# EasyEDA Pro project Motor_Driver.eprj, schematic Schematic1

## Sheets
1 P1: Board Name: Board1; Create Date: 2026-08-05; Page Name: P1; Project Name: Motor_Driver; Schematic Name: Schematic1; Update Date: 2026-08-26; Company: 嘉立创EDA; Page Size: A4; Version: V1.0
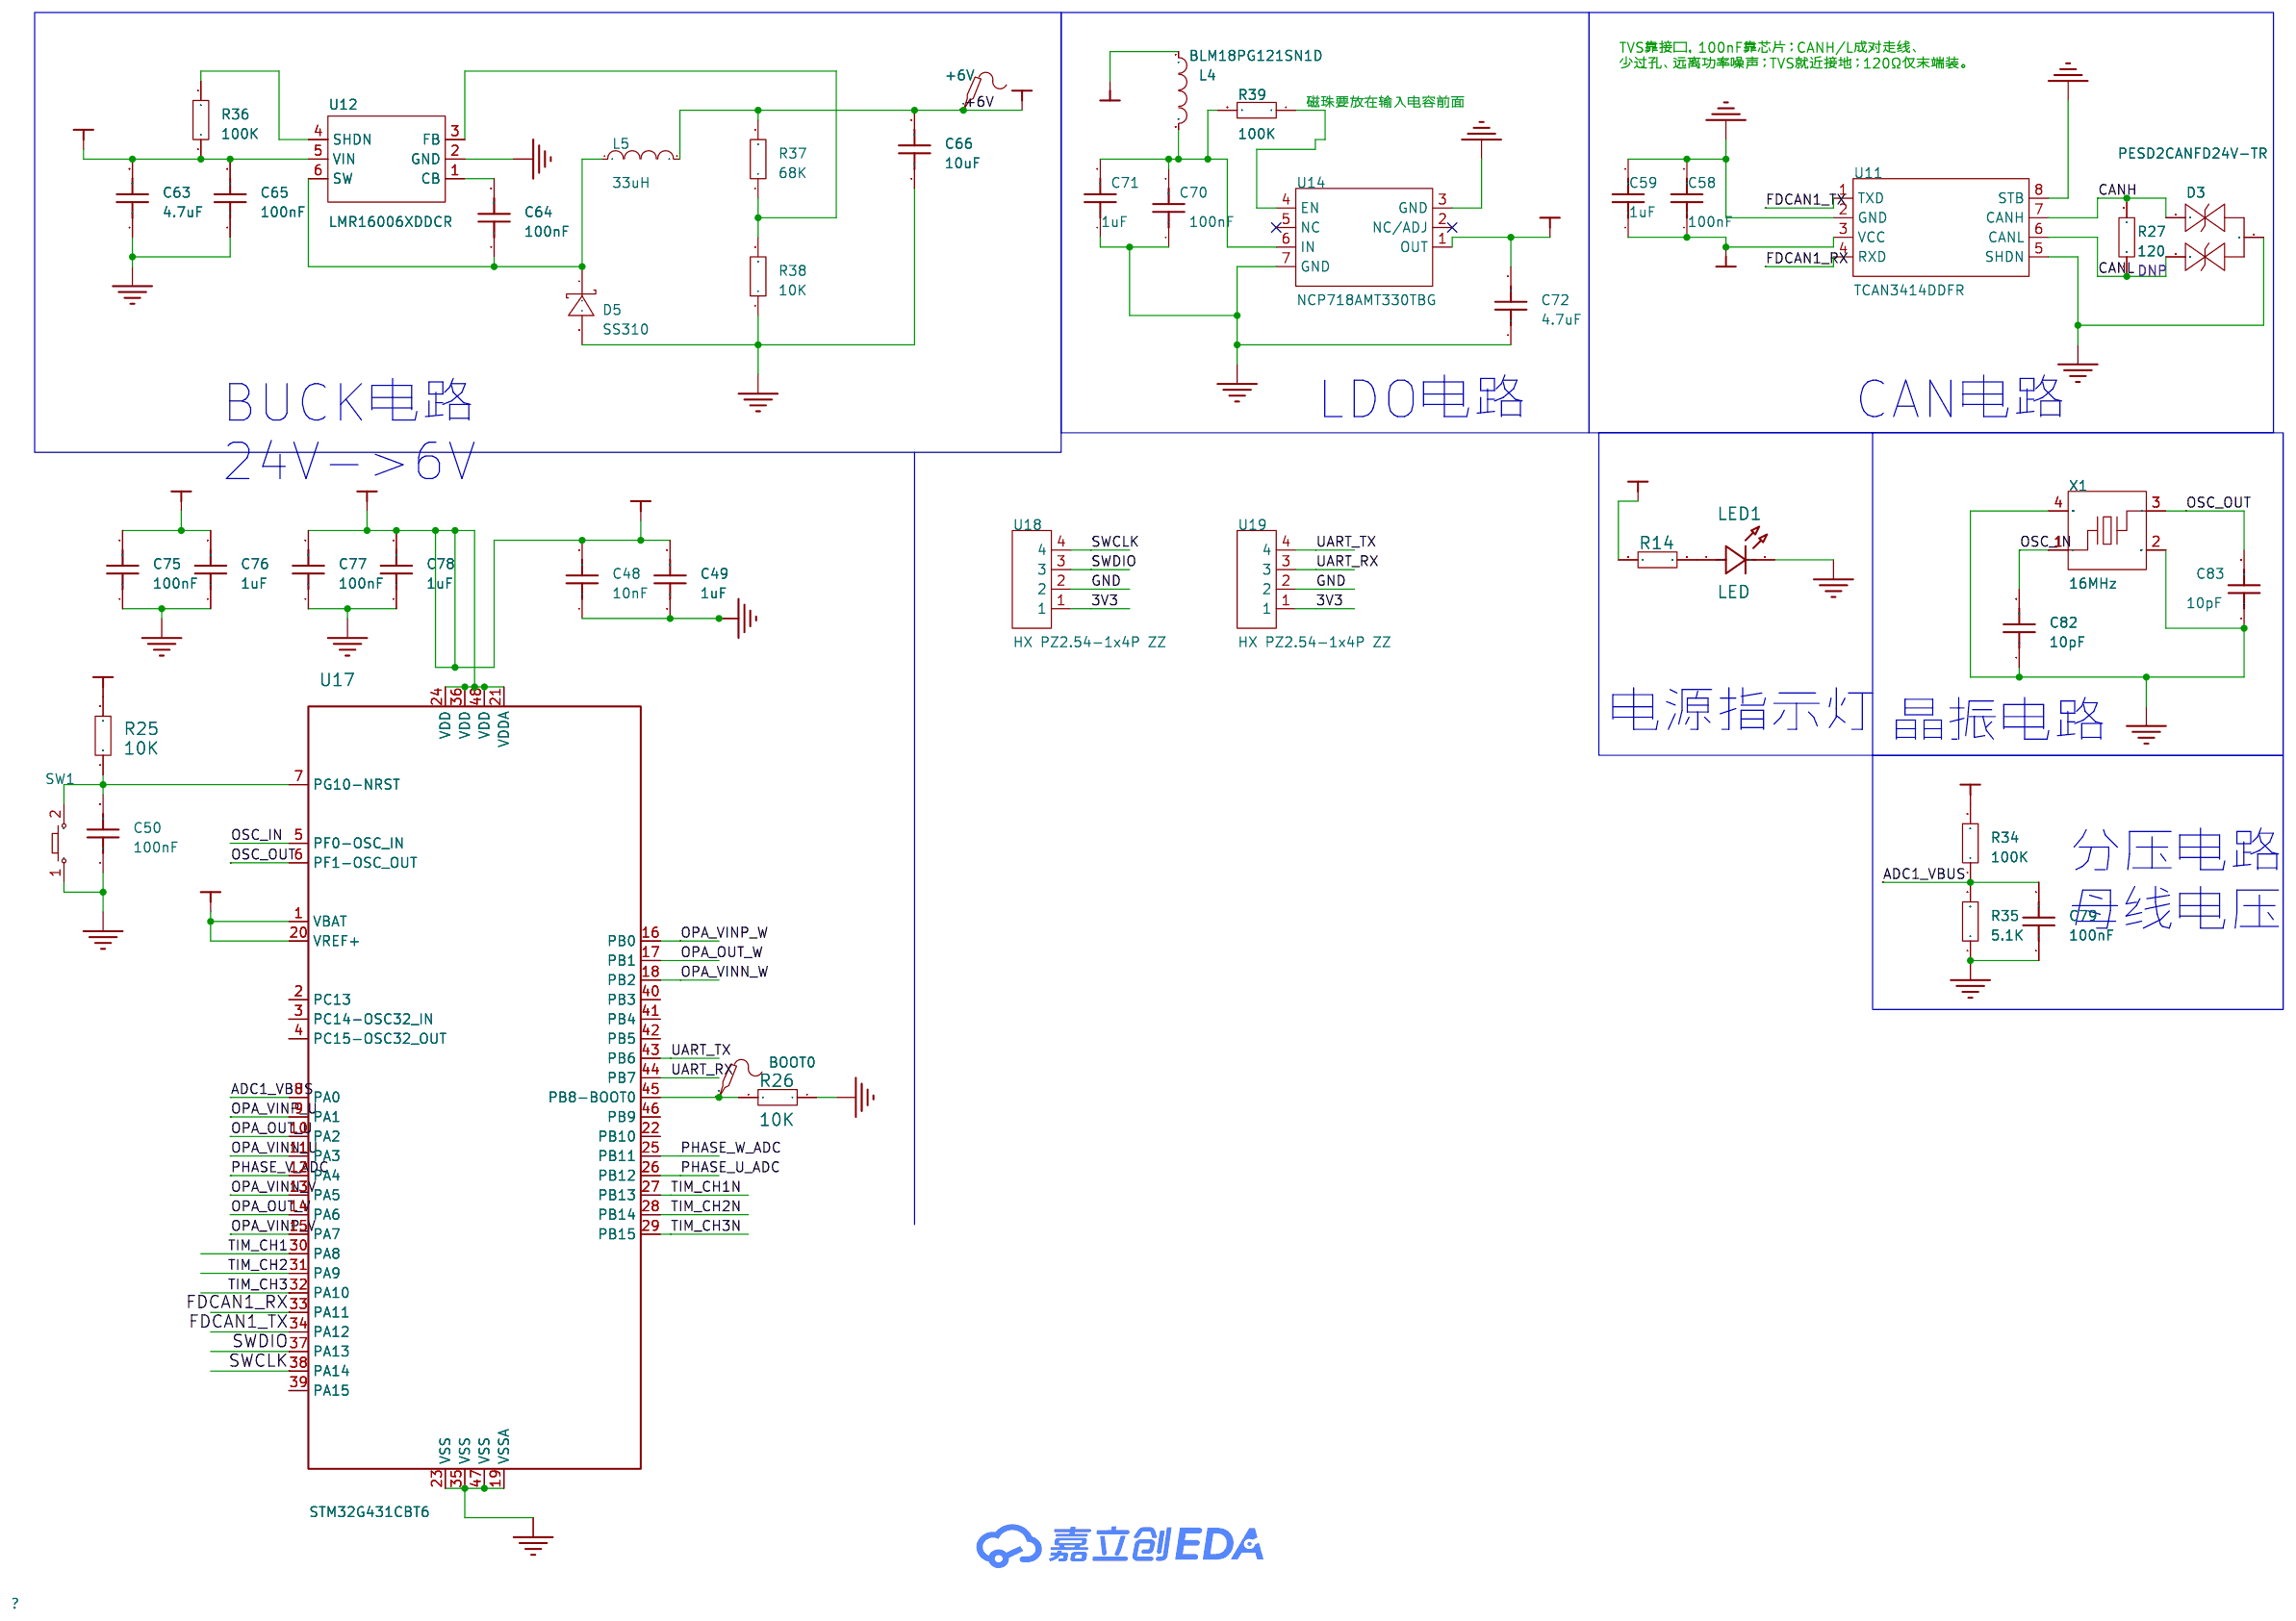
[diagram p0: P1]
2 P2: Create Date: 2026-08-13; Page Name: P2; Update Date: 2026-08-27
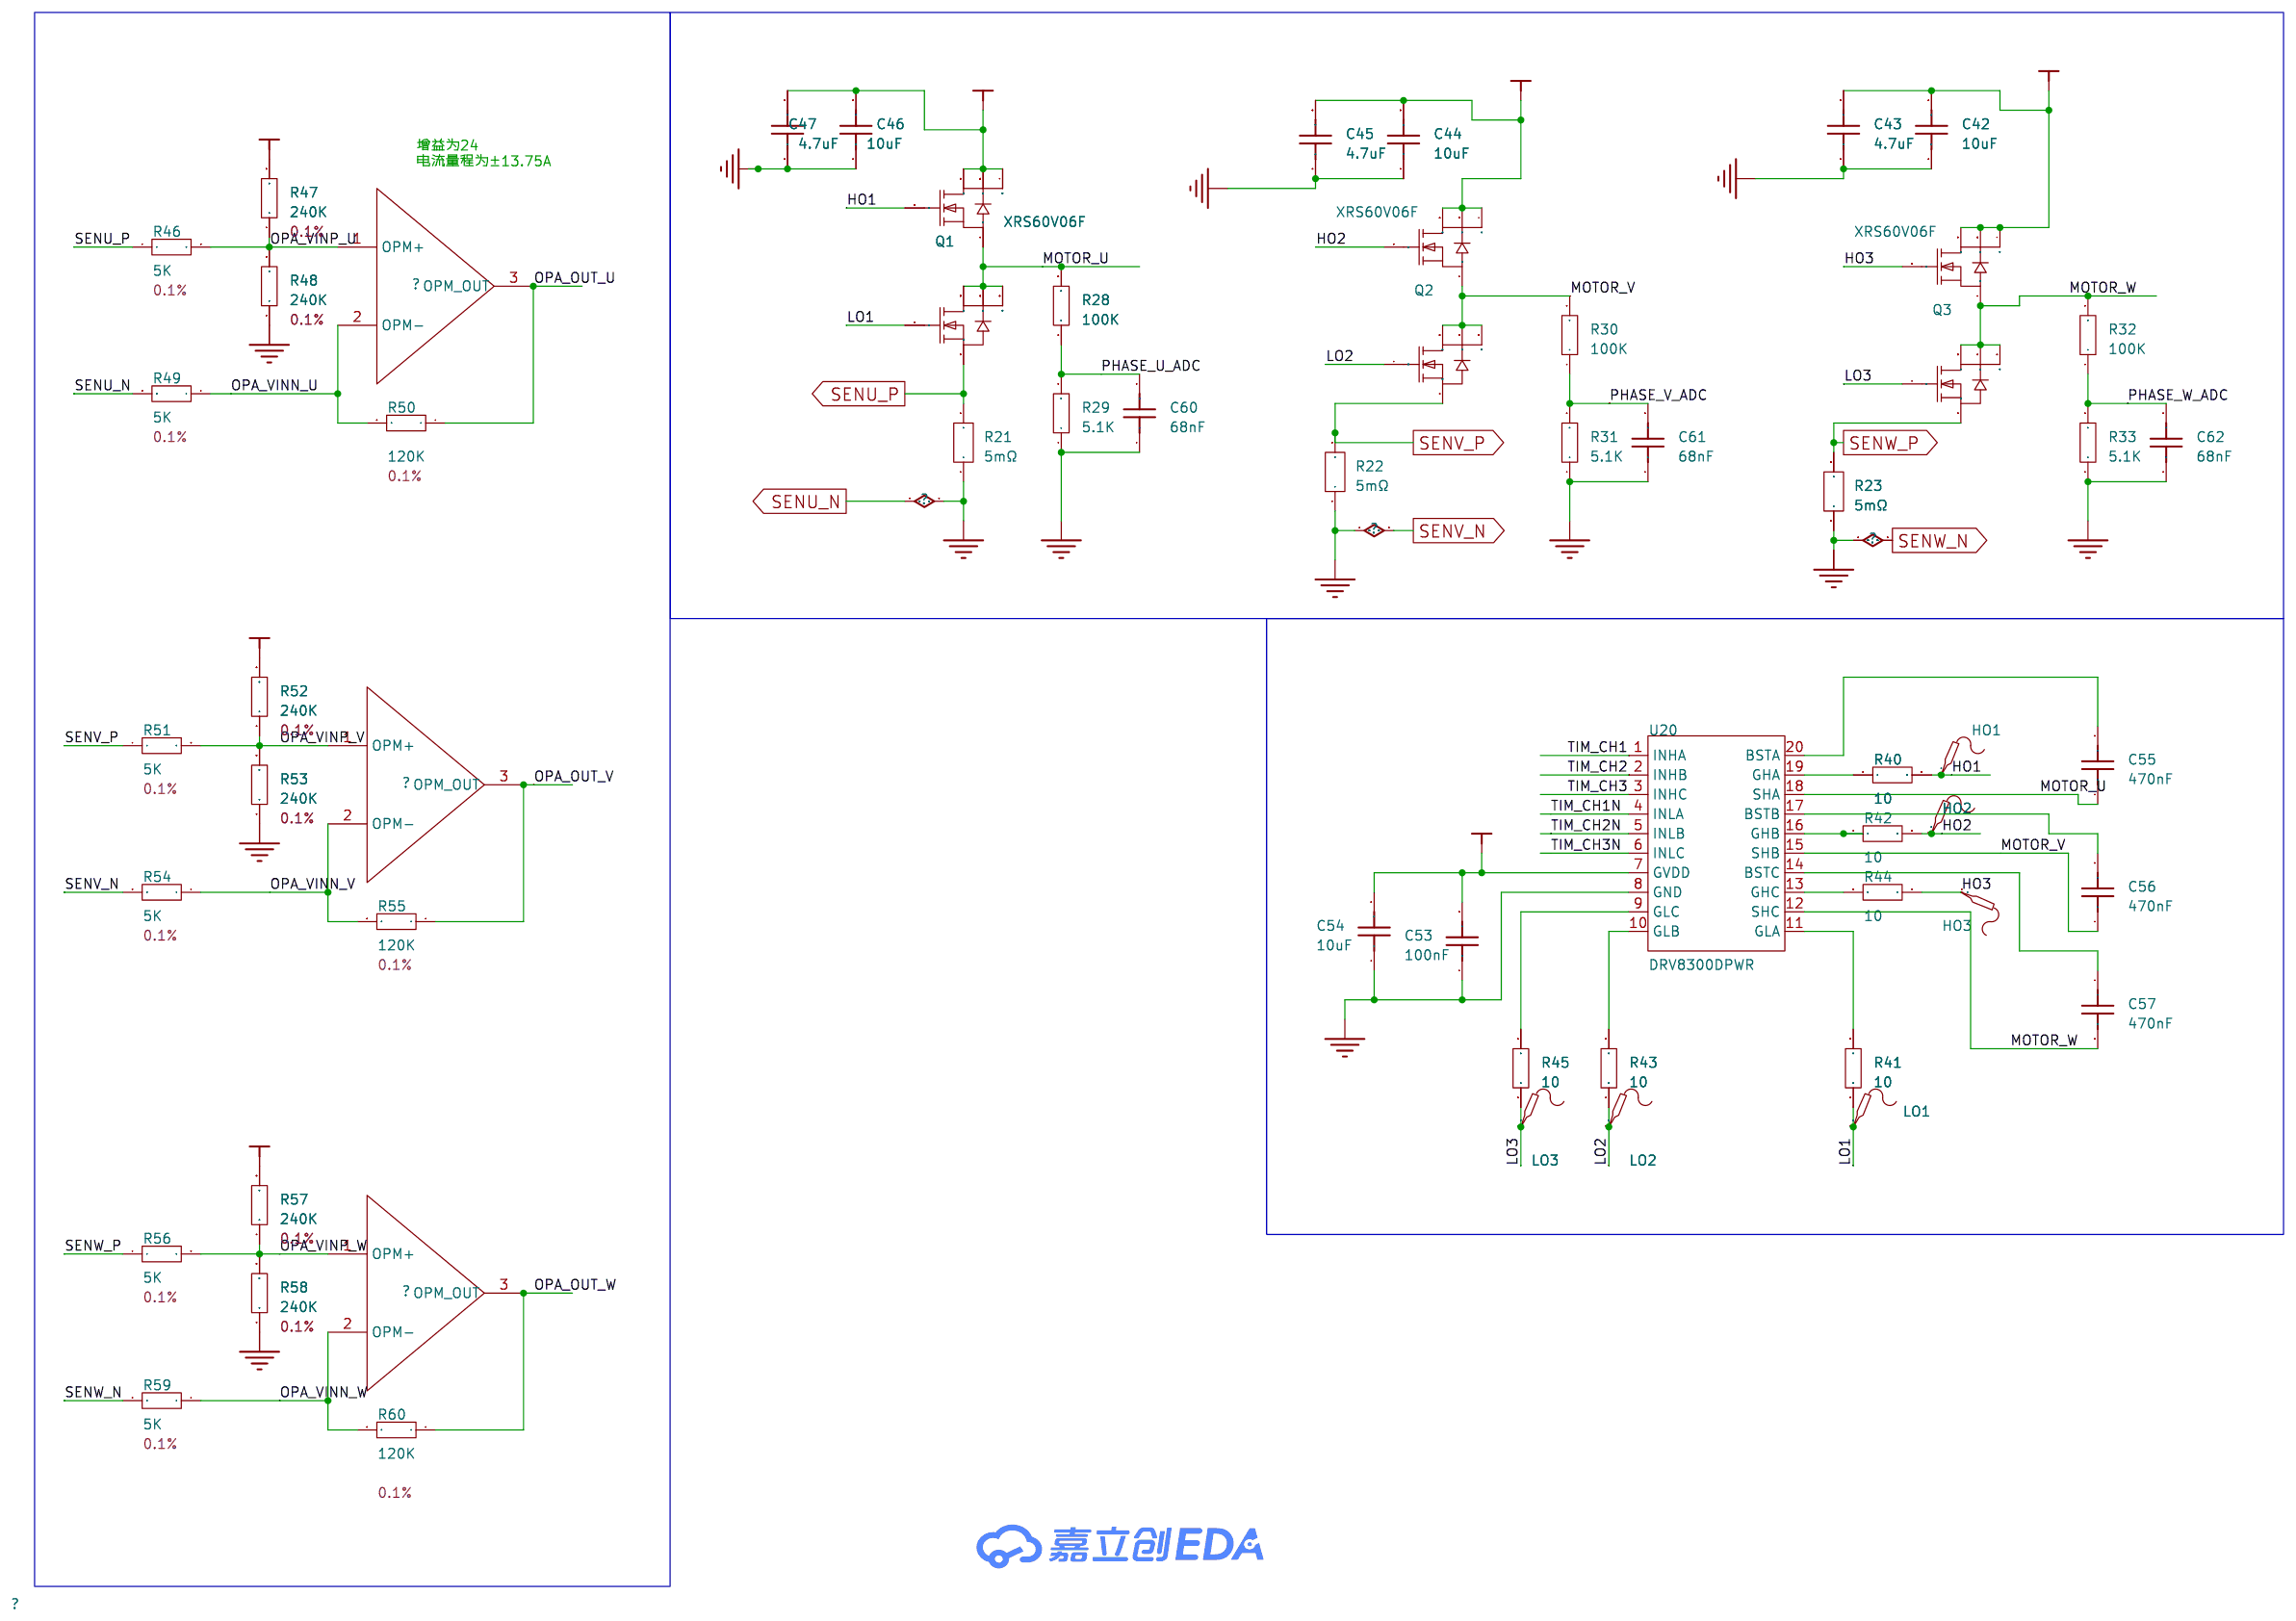
[diagram p1: P2]

## Parts
sheet P1
+6V  -  [Test-Point-0.5mm]
BOOT0  -  [Test-Point-0.5mm]
C48  10nF  [C0603]
C49  1uF  [C0603]
C50  100nF  [C0603]
C58  100nF  [C0603]
C59  1uF  [C0603]
C63  4.7uF  [C0603]
C64  100nF  [C0603]
C65  100nF  [C0603]
C66  10uF  [C0603]
C70  100nF  [C0603]
C71  1uF  [C0603]
C72  4.7uF  [C0603]
C75  100nF  [C0603]
C76  1uF  [C0603]
C77  100nF  [C0603]
C78  1uF  [C0603]
C79  100nF  [C0603]
C82  10pF  [C0603]
C83  10pF  [C0603]
D3  PESD2CANFD24V-TR  [SOT-23-3_L2.9-W1.3-P1.90-LS2.4-BR]
D5  SS310  [DO-214AC_L4.3-W2.4-LS4.7-RD]
L4  BLM18PG121SN1D  [L0603]
L5  33uH  [IND-SMD_L4.0-W4.0_FNR40XXS]
LED1  LED  [LED0603-FD]
R14  1kΩ  [R0603]
R25  10K  [R0603]
R26  10K  [R0603]
R27  120  [R0603]
R34  100K  [R0603]
R35  5.1K  [R0603]
R36  100K  [R0603]
R37  68K  [R0603]
R38  10K  [R0603]
R39  100K  [R0603]
SW1  -  [实验室微型开关]
U11  TCAN3414DDFR  [TSOT-23-8_L2.9-W1.6-P0.65-LS2.8-BR]
U12  LMR16006XDDCR  [SOT-23-6_L2.9-W1.6-P0.95-LS2.8-BR]
U14  NCP718AMT330TBG  [WDFN-6_L2.0-W2.0-P0.65-BL-EP]
U17  STM32G431CBT6  [LQFP-48_L7.0-W7.0-P0.50-LS9.0-BL]
U18  HX PZ2.54-1x4P ZZ  [HDR-TH_4P-P2.54-V-M]
U19  HX PZ2.54-1x4P ZZ  [HDR-TH_4P-P2.54-V-M]
X1  16MHz  [CRYSTAL-SMD_4P-L2.0-W1.6-BL_XL7EL89COI-111YLC-16M]
sheet P2
?#1  运算放大器  (no BOM)
?#2  运算放大器  (no BOM)
?#3  运算放大器  (no BOM)
C42  10uF  [C0603]
C43  4.7uF  [C0603]
C44  10uF  [C0603]
C45  4.7uF  [C0603]
C46  10uF  [C0603]
C47  4.7uF  [C0603]
C53  100nF  [C0603]
C54  10uF  [C0603]
C55  470nF  [C0603]
C56  470nF  [C0603]
C57  470nF  [C0603]
C60  68nF  [C0603]
C61  68nF  [C0603]
C62  68nF  [C0603]
HO1  -  [Test-Point-0.5mm]
HO2  -  [Test-Point-0.5mm]
HO3  -  [Test-Point-0.5mm]
LO1  -  [Test-Point-0.5mm]
LO2  -  [Test-Point-0.5mm]
LO3  -  [Test-Point-0.5mm]
Q1  XRS60V06F  [PDFN-8_L5.8-W4.9-P1.27-LS6.1-BL-1]
Q2  XRS60V06F  [PDFN-8_L5.8-W4.9-P1.27-LS6.1-BL-1]
Q3  XRS60V06F  [PDFN-8_L5.8-W4.9-P1.27-LS6.1-BL-1]
R21  5mΩ  [R2512]
R22  5mΩ  [R2512]
R23  5mΩ  [R2512]
R28  100K  [R0603]
R29  5.1K  [R0603]
R30  100K  [R0603]
R31  5.1K  [R0603]
R32  100K  [R0603]
R33  5.1K  [R0603]
R40  10  [R0603]
R41  10  [R0603]
R42  10  [R0603]
R43  10  [R0603]
R44  10  [R0603]
R45  10  [R0603]
R46  5K  [R0603]
R47  240K  [R0603]
R48  240K  [R0603]
R49  5K  [R0603]
R50  120K  [R0603]
R51  5K  [R0603]
R52  240K  [R0603]
R53  240K  [R0603]
R54  5K  [R0603]
R55  120K  [R0603]
R56  5K  [R0603]
R57  240K  [R0603]
R58  240K  [R0603]
R59  5K  [R0603]
R60  120K  [R0603]
U20  DRV8300DPWR  [TSSOP-20_L6.5-W4.4-P0.65-LS6.4-BL]

## Library data of the parts
+6V BOOT0 HO1-HO3 LO1-LO3 = Test-Point
C48-C50 C53-C59 C63-C66 C70-C72 C75-C79 C82 C83 = CAP_0603: Supplier Footprint: 0603
D3 = PESD2CANFD24V-TR: LCSC Part Name: 双向ESD 24V截止 峰值浪涌电流：2.6A@8/20us; Supplier Part: C552486; Manufacturer: Nexperia(安世); Supplier Footprint: SOT-23; JLCPCB Part Class: 扩展库; Datasheet: https://item.szlcsc.com/datasheet/PESD2CANFD24V-TR/573483.html; Supplier: LCSC; Polarity: 双向; Reverse Stand-Off Voltage (Vrwm): 24V; Clamping Voltage: 42V; Peak Pulse Current (Ipp): 2.6A@8/20us; Voltage - Breakdown: 25.5V; Reverse Leakage Current (Ir): 50nA; Operating Temperature: -55℃~+175℃@(Ta); level of protection: IEC 61000-4-2; Type: ESD; Junction Capacitance: 6pF
D5 = SS310: Supplier Part: C9900021858; JLCPCB Part Class: 扩展库; Supplier: LCSC
L4 = BLM18PG121SN1D: LCSC Part Name: 单路 0603磁珠 阻抗120Ω@100MHz; Supplier Part: C14709; Manufacturer: muRata(村田); Supplier Footprint: 0603; JLCPCB Part Class: 基础库; Datasheet: https://item.szlcsc.com/datasheet/BLM18PG121SN1D/15379.html; Supplier: LCSC; Impedance @ Frequency: 120Ω@100MHz; Tolerance: ±25%; DC Resistance(DCR): 50mΩ; Current Rating: 2A; Number of Circuits: 1; Operating Temperature: -55℃~+125℃
L5 = FNR4030S330MT: LCSC Part Name: 33uH ±20% 1.2A; Supplier Part: C167885; Manufacturer: cjiang(长江微电); Supplier Footprint: SMD,4x4mm; JLCPCB Part Class: 扩展库; Datasheet: https://item.szlcsc.com/datasheet/FNR4030S330MT/179268.html; Supplier: LCSC; Tolerance: ±20%; Current Rating: 920mA; Current - Saturation(Isat): 1.2A; DC Resistance(DCR): 429mΩ; Type: 磁胶屏蔽电感
LED1 = GL0603UR01: 发光颜色:红色;正向压降(Vf):2.4V;正向电流:20mA;波长:620nm~625nm;二极管配置:独立二极管;透镜颜色:无色透明透镜;发光强度:120mcd;发光角度:120°;载带方式:正贴;工作温度:-40℃~+85℃;; LCSC Part Name: 0603 红灯 高亮; Supplier Part: C51933292; Manufacturer: Guiguang light(桂光光电); Supplier Footprint: 0603; JLCPCB Part Class: Extended Part; Datasheet: https://item.szlcsc.com/datasheet/GL0603UR01/54645988.html; Supplier: LCSC; Illumination Color: 红色; Voltage - Forward(Vf): 2.4V; Forward Current: 20mA; Wavelength - Dominant: 620nm~625nm; Diode Configuration: 独立二极管; Lens Color: 无色透明透镜; Luminous Intensity: 120mcd; Viewing Angle: 120°; Mounting Style: 正贴; Operating Temperature: -40℃~+85℃
R14 = 0603WAF1001T5E: 电阻类型:厚膜电阻;阻值:1kΩ;精度:±1%;功率:100mW;工作电压:75V;温度系数:±100ppm/℃;; LCSC Part Name: 1kΩ ±1% 100mW 厚膜电阻; Supplier Part: C21190; Manufacturer: UNI-ROYAL(厚声); Supplier Footprint: 0603; JLCPCB Part Class: Basic Part; Datasheet: https://item.szlcsc.com/datasheet/0603WAF1001T5E/21904.html; Supplier: LCSC; Type: 厚膜电阻; Tolerance: ±1%; Power(Watts): 100mW; Voltage-Supply(Max): 75V; Temperature Coefficient: ±100ppm/℃; Operating Temperature: -55℃~+155℃; PCB Layer: TopLayer
R25 R26 = FRC0603F1002TS: 电阻类型:厚膜电阻;阻值:10kΩ;精度:±1%;功率:100mW;工作电压:75V;温度系数:±100ppm/℃;; LCSC Part Name: 10kΩ ±1% 100mW 厚膜电阻; Supplier Part: C2906982; Manufacturer: FOJAN(富捷); Supplier Footprint: 0603; JLCPCB Part Class: Extended Part; Supplier: LCSC; Type: 厚膜电阻; Tolerance: ±1%; Power(Watts): 100mW; Voltage-Supply(Max): 75V; Temperature Coefficient: ±100ppm/℃; Operating Temperature: -55℃~+155℃; PCB Layer: BottomLayer
R27 = Res_0603: Supplier Footprint: 0603; Comment: DNP
R34-R45 = Res_0603: Supplier Footprint: 0603
SW1 = 实验室微型开关
U11 = TCAN3414DDFR: 类型:CAN-FD收发器;数据速率:8Mbps;; LCSC Part Name: 具有待机模式和±58V总线关断的3.3V CAN FD收发器; Supplier Part: C24836183; Manufacturer: TI(德州仪器); Supplier Footprint: TSOT-23-8; JLCPCB Part Class: 扩展库; Datasheet: https://www.ti.com.cn/cn/lit/ds/symlink/tcan3414.pdf?ts=1738808603330&ref_url=https%253A%252F%252Fwww.ti.com.cn%252Fsitesearch%252Fzh-cn%252Fdocs%252Funiversalsearch.tsp%253FlangPref%253Dzh-CN%2526nr%253D9%2526searchTerm%253DTCAN3414DDFR; Supplier: LCSC; Type: CAN-FD收发器; Data Rate: 8Mbps; Voltage - Supply: 3.3V; Current - Supply: 55mA; Operating Temperature: -40℃~+150℃; Number of Channels: 1; Quiescent Supply Current: 17uA; Features: 唤醒功能；热插拔保护；欠压保护；热关断保护；ESD保护；TXD占优超时；低功耗模式；总线故障保护
U12 = LMR16006XDDCR: LCSC Part Name: 降压型 600mA 4V~60V; Supplier Part: C87080; Manufacturer: TI(德州仪器); Supplier Footprint: SOT-6; JLCPCB Part Class: 扩展库; Datasheet: https://www.ti.com/cn/lit/gpn/lmr16006; Supplier: LCSC; Function: 降压型; Voltage - Supply: 4V~60V; Output Voltage: 765mV~55V; Output Current: 600mA; Frequency - Switching: 700kHz; Operating Temperature: -40℃~+125℃@(TJ); Synchronous Rectifier: 否; Number of Outputs: 1; Topology: 降压式; Quiescent Current: 28uA; Switch tube (built-in/external): 内置; Output Type: 可调; Features: 轻载高效模式；逐波限流；过流保护
U14 = NCP718AMT330TBG: LCSC Part Name: 300 mA低 dropout 稳压器，宽输入电压，低 lq; Supplier Part: C603783; Manufacturer: onsemi(安森美); Supplier Footprint: WDFN-6(2x2); JLCPCB Part Class: 扩展库; Datasheet: https://item.szlcsc.com/datasheet/NCP718AMT330TBG/633211.html; Supplier: LCSC; Output Type: 固定; Voltage - Supply: 24V; Output Voltage: 3.3V; Output Current: 300mA; Power Supply Rejection Ratio (PSRR): 60dB@(1kHz); Noise: 36uVrms; Features: 过流保护；带使能；过热保护; Operating Temperature: -40℃~+125℃; Output Configuration: 正极; Number of Outputs: 1
U17 = STM32G431CBT6: LCSC Part Name: 带DSP和FPU的170MHz主流ARM Cortex-M4 MCU，具有128 KB Flash存储器、数学加速器和中等模拟电平集成; Supplier Part: C529355; Manufacturer: ST(意法半导体); Supplier Footprint: LQFP-48(7x7); JLCPCB Part Class: 扩展库; Datasheet: https://item.szlcsc.com/datasheet/STM32G431CBT6/549633.html; Supplier: LCSC; CPU Core: ARM Cortex-M4F; CPU Maximum Speed: 170MHz; Core Size: 32 Bit; Program Storage Size: 128KB; Program Memory Type: FLASH; RAM Size: 32KB; Number of I/O: 38; ADC (Bit): 12bit; DAC (Bit): 12bit; Oscillator Type: 内置; Voltage - Supply: 1.71V~3.6V; Operating Temperature: -40℃~+85℃
U18 U19 = HX PZ2.54-1x4P ZZ: LCSC Part Name: 1x4P 间距:2.54mm 方针 直插; Supplier Part: C32713270; Manufacturer: hanxia(韩下); Supplier Footprint: 插件,P=2.54mm; JLCPCB Part Class: 扩展库; Datasheet: https://item.szlcsc.com/datasheet/HX%2520PZ2.54-1x4P%2520ZZ/34444550.html; Supplier: LCSC; Pin Structure: 1x4P; Pitch: 2.54mm; Circluar Pins/Square Pins: 方针; Mounting Type: 直插; Number of Rows: 单排; Number of Pins: 4P; Current Rating: 3A; Voltage Rating (Max): 1kV; Length of Mating Pin: 6mm; Insulation Height: 2.5mm; Length of End Connection Pin: 3mm; Contact Material: 黄铜; Contact Plating: 金; Operating Temperature: -40℃~+105℃; Color: 黑色
X1 = XL7EL89COI-111YLC-16M: LCSC Part Name: YSX211SL 16MHZ 12PF ±10PPM -40~85℃; Supplier Part: C2965579; Manufacturer: YXC(扬兴晶振); Supplier Footprint: SMD2016-4P; JLCPCB Part Class: 扩展库; Datasheet: https://item.szlcsc.com/datasheet/XL7EL89COI-111YLC-16M/3357715.html; Supplier: LCSC; Type: 贴片晶振; Normal temperature Frequency Tolerance: ±10ppm; Load Capacitance: 12pF; Frequency Stability: ±20ppm; Operating Temperature: -40℃~+85℃
?#1-?#3 = 运算放大器
C42 C44 C46 = CAP_0603: Supplier Footprint: 0603; Height: 0mm; 额定电压: 50V
C43 C45 C47 = CAP_0603: Supplier Footprint: 0603; 额定电压: 50V
C60-C62 = CAP_0603: Supplier Footprint: 0603; Comment: X7R
Q1-Q3 = XRS60V06F: 数量:2个N沟道;漏源电压(Vdss):60V;连续漏极电流(Id):50A;导通电阻(RDS(on)):9mΩ@10V,20A;耗散功率(Pd):60W;阈值电压(Vgs(th)):1.6V;; LCSC Part Name: 双N沟道60V MOSFET; Supplier Part: C42457040; Manufacturer: XNRUSEMI(新锐); Supplier Footprint: PDFN-8L(5x6); JLCPCB Part Class: 扩展库; Datasheet: https://item.szlcsc.com/datasheet/XRS60V06F/44528130.html; Supplier: LCSC; Number: 2个N沟道; Drain to Source Voltage: 60V; Current - Continuous Drain(Id): 50A; RDS(on): 9mΩ@10V,20A; Pd - Power Dissipation: 60W; Gate Threshold Voltage (Vgs(th)): 1.6V; Gate Charge(Qg): 22nC@30V; Input Capacitance(Ciss): 930pF@25V; Reverse Transfer Capacitance (Crss@Vds): 8pF@25V; Operating Temperature: -55℃~+150℃; Type: N沟道; Output Capacitance(Coss): 230pF
R21-R23 = JER2512F3R005: LCSC Part Name: 5mΩ 3W 2512 ±1%; Supplier Part: C46634460; Manufacturer: JIERR(捷而瑞); Supplier Footprint: 2512; JLCPCB Part Class: 扩展库; Datasheet: https://item.szlcsc.com/datasheet/JER2512F3R005/48788262.html; Supplier: LCSC; Type: 采样电阻；合金电阻; Tolerance: ±1%; Power(Watts): 3W; Temperature Coefficient: ±50ppm/℃
R28-R33 = Res_0603: Supplier Footprint: 0603; 精度: 1%
R46-R60 = Res_0603: Supplier Footprint: 0603; 精度: 0.1%
U20 = DRV8300DPWR: LCSC Part Name: 100V三相BLDC栅极驱动器; Supplier Part: C3036056; Manufacturer: TI(德州仪器); Supplier Footprint: TSSOP-20; JLCPCB Part Class: 扩展库; Datasheet: https://www.ti.com/cn/lit/gpn/drv8300; Supplier: LCSC; Output Current: 750mA；1.5A; Peak Current: 1.5A; Operating Temperature: -40℃~+125℃

## Nets
3V3: C48.2 C49.2 C58.1 C59.1 C72.2 C75.2 C76.2 C77.2 C78.2 R14.1 R25.2 R47.2 R52.2 R57.2 U11.3(VCC) U14.1(OUT) U17.1(VBAT) U17.20(VREF+) U17.21(VDDA) U17.24(VDD) U17.36(VDD) U17.48(VDD) U18.1 U19.1
+6V: +6V.1 C53.2 C54.2 C66.2 L4.1 L5.2 R37.2 U20.7(GVDD)
GND: C42.1 C43.1 C44.1 C45.1 C46.1 C47.1 C48.1 C49.1 C50.1 C53.1 C54.1 C58.2 C59.2 C60.1 C61.1 C62.1 C63.1 C65.1 C66.1 C70.1 C71.1 C72.1 C75.1 C76.1 C77.1 C78.1 C79.1 C82.1 C83.1 D3.3 D5.2(A) LED1.2(C) R21.1 R22.1 R23.1 R26.1 R29.1 R31.1 R33.1 R35.1 R38.1 R48.1 R49.2 R53.1 R54.2 R58.1 R59.2 SW1.1 U11.2(GND) U11.5(SHDN) U11.8(STB) U12.2(GND) U14.3(GND) U14.7(GND) U17.19(VSSA) U17.23(VSS) U17.35(VSS) U17.47(VSS) U18.2 U19.2 U20.8(GND) X1.2(GND) X1.4(GND)
VBUS: C42.2 C43.2 C44.2 C45.2 C46.2 C47.2 C63.2 C65.2 Q1.7(D1) Q1.8(D1) Q1.9(D1) Q2.7(D1) Q2.8(D1) Q2.9(D1) Q3.7(D1) Q3.8(D1) Q3.9(D1) R34.2 R36.1 U12.5(VIN)
ADC1_VBUS: C79.2 R34.1 R35.2 U17.8(PA0)
CANH: D3.1 R27.2 U11.7(CANH)
CANL: D3.2 R27.1 U11.6(CANL)
FDCAN1_RX: U11.4(RXD) U17.33(PA11)
FDCAN1_TX: U11.1(TXD) U17.34(PA12)
HO1: HO1.1 Q1.2(G1) R40.2
HO2: HO2.1 Q2.2(G1) R42.2
HO3: HO3.1 Q3.2(G1) R44.1
LO1: LO1.1 Q1.4(G2) R41.1
LO2: LO2.1 Q2.4(G2) R43.1
LO3: LO3.1 Q3.4(G2) R45.1
MOTOR_U: C55.1 Q1.1(S1) Q1.5(D2) Q1.6(D2) Q1.10(D2) R28.2 U20.18(SHA)
MOTOR_V: C56.1 Q2.1(S1) Q2.5(D2) Q2.6(D2) Q2.10(D2) R30.2 U20.15(SHB)
MOTOR_W: C57.2 Q3.1(S1) Q3.5(D2) Q3.6(D2) Q3.10(D2) R32.2 U20.12(SHC)
OPA_OUT_U: ?#1.3(OPM_OUT) R50.1 U17.10(PA2)
OPA_OUT_V: ?#2.3(OPM_OUT) R55.1 U17.14(PA6)
OPA_OUT_W: ?#3.3(OPM_OUT) R60.1 U17.17(PB1)
OPA_VINN_U: ?#1.2(OPM-) R49.1 R50.2 U17.11(PA3)
OPA_VINN_V: ?#2.2(OPM-) R54.1 R55.2 U17.13(PA5)
OPA_VINN_W: ?#3.2(OPM-) R59.1 R60.2 U17.18(PB2)
OPA_VINP_U: ?#1.1(OPM+) R46.2 R47.1 R48.2 U17.9(PA1)
OPA_VINP_V: ?#2.1(OPM+) R51.2 R52.1 R53.2 U17.15(PA7)
OPA_VINP_W: ?#3.1(OPM+) R56.2 R57.1 R58.2 U17.16(PB0)
OSC_IN: C82.2 U17.5(PF0-OSC_IN) X1.1
OSC_OUT: C83.2 U17.6(PF1-OSC_OUT) X1.3
PHASE_U_ADC: C60.2 R28.1 R29.2 U17.26(PB12)
PHASE_V_ADC: C61.2 R30.1 R31.2 U17.12(PA4)
PHASE_W_ADC: C62.2 R32.1 R33.2 U17.25(PB11)
SENU_P: Q1.3(S2) R21.2 R46.1
SENV_P: Q2.3(S2) R22.2 R51.1
SENW_P: Q3.3(S2) R23.2 R56.1
SWCLK: U17.38(PA14) U18.4
SWDIO: U17.37(PA13) U18.3
TIM_CH1: U17.30(PA8) U20.1(INHA)
TIM_CH1N: U17.27(PB13) U20.4(INLA)
TIM_CH2: U17.31(PA9) U20.2(INHB)
TIM_CH2N: U17.28(PB14) U20.5(INLB)
TIM_CH3: U17.32(PA10) U20.3(INHC)
TIM_CH3N: U17.29(PB15) U20.6(INLC)
UART_RX: U17.44(PB7) U19.3
UART_TX: U17.43(PB6) U19.4
$1N3867: LED1.1(A) R14.2
$1N8632: R36.2 U12.4(SHDN)
$1N8748: C64.2 U12.1(CB)
$1N8755: C64.1 D5.1(K) L5.1 U12.6(SW)
$1N8903: R37.1 R38.2 U12.3(FB)
$1N10119: C70.2 C71.2 L4.2 R39.2 U14.6(IN)
$1N14795: R39.1 U14.4(EN)
$1N25856: BOOT0.1 R26.2 U17.45(PB8-BOOT0)
$1N26138: C50.2 R25.1 SW1.2 U17.7(PG10-NRST)
$2N28004: R41.2 U20.11(GLA)
$2N28109: R45.2 U20.9(GLC)
$2N28121: R43.2 U20.10(GLB)
$2N28169: R40.1 U20.19(GHA)
$2N28215: R42.1 U20.16(GHB)
$2N28287: R44.2 U20.13(GHC)
$2N28379: C55.2 U20.20(BSTA)
$2N28399: C56.2 U20.17(BSTB)
$2N28418: C57.1 U20.14(BSTC)

Not connected (* = marked no-connect by the designer): U14 2(NC/ADJ)* 5(NC)*; U17 2(PC13) 3(PC14-OSC32_IN) 4(PC15-OSC32_OUT) 22(PB10) 39(PA15) 40(PB3) 41(PB4) 42(PB5) 46(PB9)

## Notes on the sheets
sheet 1
- TVS靠接口，100nF靠芯片；CANH/L成对走线、
  少过孔、远离功率噪声；TVS就近接地；120Ω仅末端装。
- 磁珠要放在输入电容前面
- BUCK电路
  24V->6V
- LDO电路
- CAN电路
- 电源指示灯
- 晶振电路
- 分压电路
  母线电压
sheet 2
- 增益为24
  电流量程为±13.75A
